# EAGLE schematic Francesco (EAGLE 6.4)
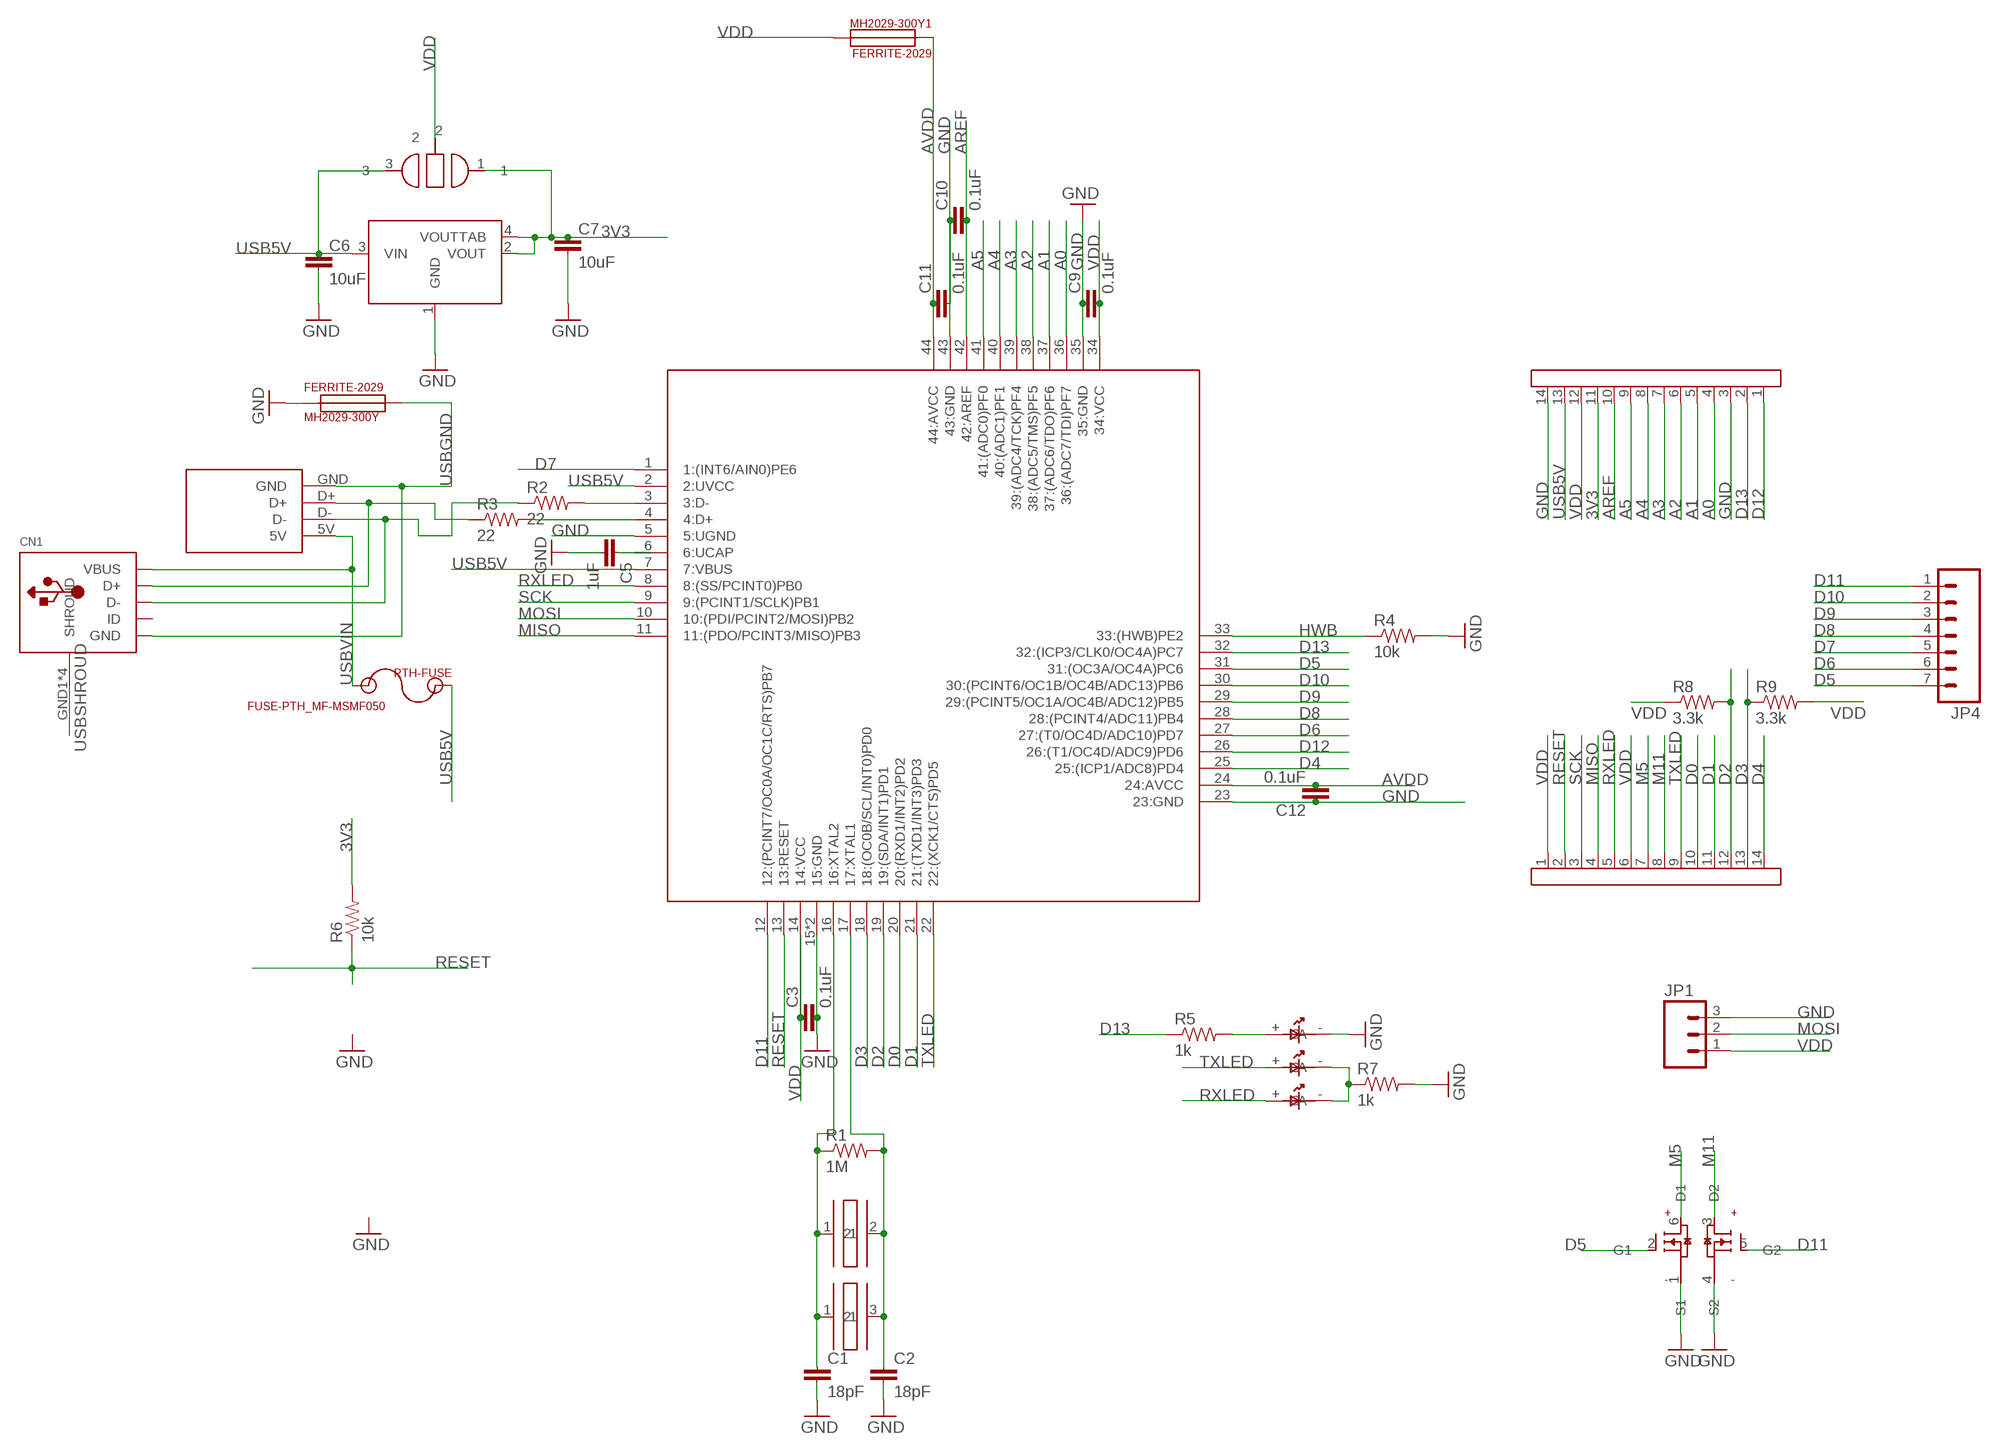
[diagram p0: schematic, sheet 1]

## Parts
C1  18pF  CAP0603-CAP  [0603-CAP]
C2  18pF  CAP0603-CAP  [0603-CAP]
C3  0.1uF  CAP0805  [0805]
C5  1uF  CAP0805  [0805]
C6  10uF  CAP1210  [1210]
C7  10uF  CAP1210  [1210]
C9  0.1uF  CAP0805  [0805]
C10  0.1uF  CAP0805  [0805]
C11  0.1uF  CAP0805  [0805]
C12  0.1uF  CAP0805  [0805]
CN1  USBMINIB  [USB-MINIB]
JP1  M03LOCK  [1X03_LOCK]
JP4  M07LOCK  [1X07_LOCK]
MH2029-300Y  FERRITE-2029  [2029]
MH2029-300Y1  FERRITE-2029  [2029]
PTH-FUSE  FUSE-PTH_MF-MSMF050  FUSE-PTH_MF-MSMF  [MF-MSMF]
R1  1M  RESISTOR  [0805]
R2  22  RESISTOR0603-RES  [0603-RES]
R3  22  RESISTOR0603-RES  [0603-RES]
R4  10k  RESISTOR  [0805]
R5  1k  RESISTOR  [0805]
R6  10k  RESISTOR  [0805]
R7  1k  RESISTOR  [0805]
R8  3.3k  RESISTOR  [0805]
R9  3.3k  RESISTOR  [0805]
U$1  ATMEGA32U4  [QFN-44]
U$2  HC49US  [HC49US]
U$3  USB-PCB  [USB_PCB]
U$4  5V-LDO-ZLDO1117  [ZLDO1117]
U$5  M14  [1X14_LOCK]
U$6  M14  [1X14_LOCK]
U$7  BRIDGE-3  [BRIDGE-3]
U$8  CRYSTAL-3.2X2.5  [XTAL3.2X2.5]
U$9  LED0805  [0805-LED]
U$10  LED0805  [0805-LED]
U$11  LED0805  [0805-LED]
U$12  N-DUAL-MOSFET  [SOT-363]

## Nets
3V3: C7.1 R6.2 U$4.2(VOUT) U$4.4(VOUTTAB) U$6.11 U$7.1
A0: U$1.36(36:(ADC7/TDI)PF7) U$6.4
A1: U$1.37(37:(ADC6/TDO)PF6) U$6.5
A2: U$1.38(38:(ADC5/TMS)PF5) U$6.6
A3: U$1.39(39:(ADC4/TCK)PF4) U$6.7
A4: U$1.40(40:(ADC1)PF1) U$6.8
A5: U$1.41(41:(ADC0)PF0) U$6.9
AREF: C10.2 U$1.42(42:AREF) U$6.10
AVDD: C11.1 C12.2 MH2029-300Y1.P$1 U$1.24(24:AVCC) U$1.44(44:AVCC)
D0: U$1.20(20:(RXD1/INT2)PD2) U$5.10
D1: U$1.21(21:(TXD1/INT3)PD3) U$5.11
D2: R8.2 U$1.19(19:(SDA/INT1)PD1) U$5.12
D3: R9.1 U$1.18(18:(OC0B/SCL/INT0)PD0) U$5.13
D4: U$1.25(25:(ICP1/ADC8)PD4) U$5.14
D5: JP4.7 U$1.31(31:(OC3A/OC4A)PC6) U$12.2(G1)
D6: JP4.6 U$1.27(27:(T0/OC4D/ADC10)PD7)
D7: JP4.5 U$1.1(1:(INT6/AIN0)PE6)
D8: JP4.4 U$1.28(28:(PCINT4/ADC11)PB4)
D9: JP4.3 U$1.29(29:(PCINT5/OC1A/OC4B/ADC12)PB5)
D10: JP4.2 U$1.30(30:(PCINT6/OC1B/OC4B/ADC13)PB6)
D11: JP4.1 U$1.12(12:(PCINT7/OC0A/OC1C/RTS)PB7) U$12.5(G2)
D12: U$1.26(26:(T1/OC4D/ADC9)PD6) U$6.1
D13: R5.1 U$1.32(32:(ICP3/CLK0/OC4A)PC7) U$6.2
D+: R3.2 U$1.4(4:D+)
D+IN: CN1.D+ R3.1 U$3.D+
D-: R2.2 U$1.3(3:D-)
D-IN: CN1.D- R2.1 U$3.D-
GND: C1.2 C2.2 C3.2 C5.2 C6.2 C7.2 C9.1 C10.1 C11.2 C12.1 JP1.3 MH2029-300Y.P$1 R4.2 R7.2 U$1.5(5:UGND) U$1.15(15:GND) U$1.23(23:GND) U$1.35(35:GND) U$1.43(43:GND) U$1.PAD(15:GND) U$4.1(GND) U$6.3 U$6.14 U$9.-(C) U$12.1(S1) U$12.4(S2)
HWB: R4.1 U$1.33(33:(HWB)PE2)
M5: U$5.7 U$12.6(D1)
M11: U$5.8 U$12.3(D2)
MISO: U$1.11(11:(PDO/PCINT3/MISO)PB3) U$5.4
MOSI: JP1.2 U$1.10(10:(PDI/PCINT2/MOSI)PB2)
N$1: C1.1 R1.1 U$1.16(16:XTAL2) U$2.1 U$8.1
N$2: C2.1 R1.2 U$1.17(17:XTAL1) U$2.2 U$8.3
N$3: R7.1 U$10.-(C) U$11.-(C)
N$4: R5.2 U$9.+(A)
RESET: R6.1 U$1.13(13:RESET) U$5.2
RXLED: U$1.8(8:(SS/PCINT0)PB0) U$5.5 U$11.+(A)
SCK: U$1.9(9:(PCINT1/SCLK)PB1) U$5.3
TXLED: U$1.22(22:(XCK1/CTS)PD5) U$5.9 U$10.+(A)
UCAP: C5.1 U$1.6(6:UCAP)
USB5V: C6.1 PTH-FUSE.P$1 U$1.2(2:UVCC) U$1.7(7:VBUS) U$4.3(VIN) U$6.13 U$7.3
USBGND: CN1.GND MH2029-300Y.P$2 U$3.GND
USBSHROUD: CN1.GND1(SHROUD) CN1.GND2(SHROUD) CN1.GND3(SHROUD) CN1.GND4(SHROUD)
USBVIN: CN1.VBUS PTH-FUSE.P$2 U$3.5V
VDD: C3.1 C9.2 JP1.1 MH2029-300Y1.P$2 R8.1 R9.2 U$1.14(14:VCC) U$1.34(34:VCC) U$5.1 U$5.6 U$6.12 U$7.2
Unconnected: CN1.ID

## Library data of the parts
C1-C3 C5-C7 C9-C12 = 1dah:CAP: Capacitor Standard 0402 ceramic capacitor, and 0.1" leaded capacitor.
CN1 = adafruit:USB: USB Connectors USBMINIB - Surface Mount Female Mini-B USB Connector 4UConnector: 06564 By microbuilder.eu Thru-hole RA Female Mini-B USB Connector 4UConnector: 18732 By ladyada.net
JP1 = 1dah:M03: Header 3 Standard 3-pin 0.1" header. Use with straight break away headers (SKU : PRT-00116), right angle break away headers (PRT-00553), swiss pins (PRT-00743), machine pins (PRT-00117), and female headers (PRT-00115). Molex polarized connector foot print use with SKU : PRT-08232 with associated crimp pins and housings.
JP4 = 1dah:M07: Header 7 Standard 7-pin 0.1" header. Use with straight break away headers (SKU : PRT-00116), right angle break away headers (PRT-00553), swiss pins (PRT-00743), machine pins (PRT-00117), and female headers (PRT-00115). NOTES ON THE VARIANTS LOCK and LOCK_LONGPADS... This footprint was designed to help hold the alignment of a through-hole component (i.e. 7-pin header) while soldering it into place. You may notice that each hole has been shifted either up or down by 0.005 of an inch from it's more standard position (which is usually a perfectly straight line). This slight alteration caused the pins (the squares in the middle) to touch the edges of the holes. Because they are alternating, it causes a "brace" to hold the header in place. 0.005 has proven to be the perfect amount of "off-center" position when using our standard breakaway headers. Although looks a little odd when you look at the bare footprint, once you have a header in there, the alteration is very hard to notice. Also, if you push a header all the way into place, it is covered up entirely on the bottom side. This idea of altering the position of holes to aid alignment will be further integrated into the Sparkfun Library for other footprints. It can help hold any component with 3 or more connection pins.
MH2029-300Y MH2029-300Y1 = 1dah:FERRITE
PTH-FUSE = 1dah:FUSE
R1-R9 = 1dah:RESISTOR: Resistor Basic schematic elements and footprints for 0603, 1206, and PTH 1/10th watt (small) resistors.
U$1 = 1dah:ATMEGA32U4
U$2 = 1dah:HC49US: 16 MHz crystal
U$3 = 1dah:USB
U$4 = 1dah:5V-LDO: 5 V LDO, 12V input, 1 A
U$5 U$6 = 1dah:M14
U$7 = 1dah:BRIDGE-3: solderable SPDT bridge
U$8 = 1dah:CRYSTAL
U$9-U$11 = 1dah:LED
U$12 = 1dah:N-DUAL-MOSFET